# EasyEDA Pro project 嘉立创电路图.eprj

# Schematic Schematic1
Create Date: 2023-12-07; Page Name: P1; Project Name: 1; Schematic Name: Schematic1; Update Date: 2023-12-08; Company: 嘉立创EDA; Page Size: A4; Version: V1.0
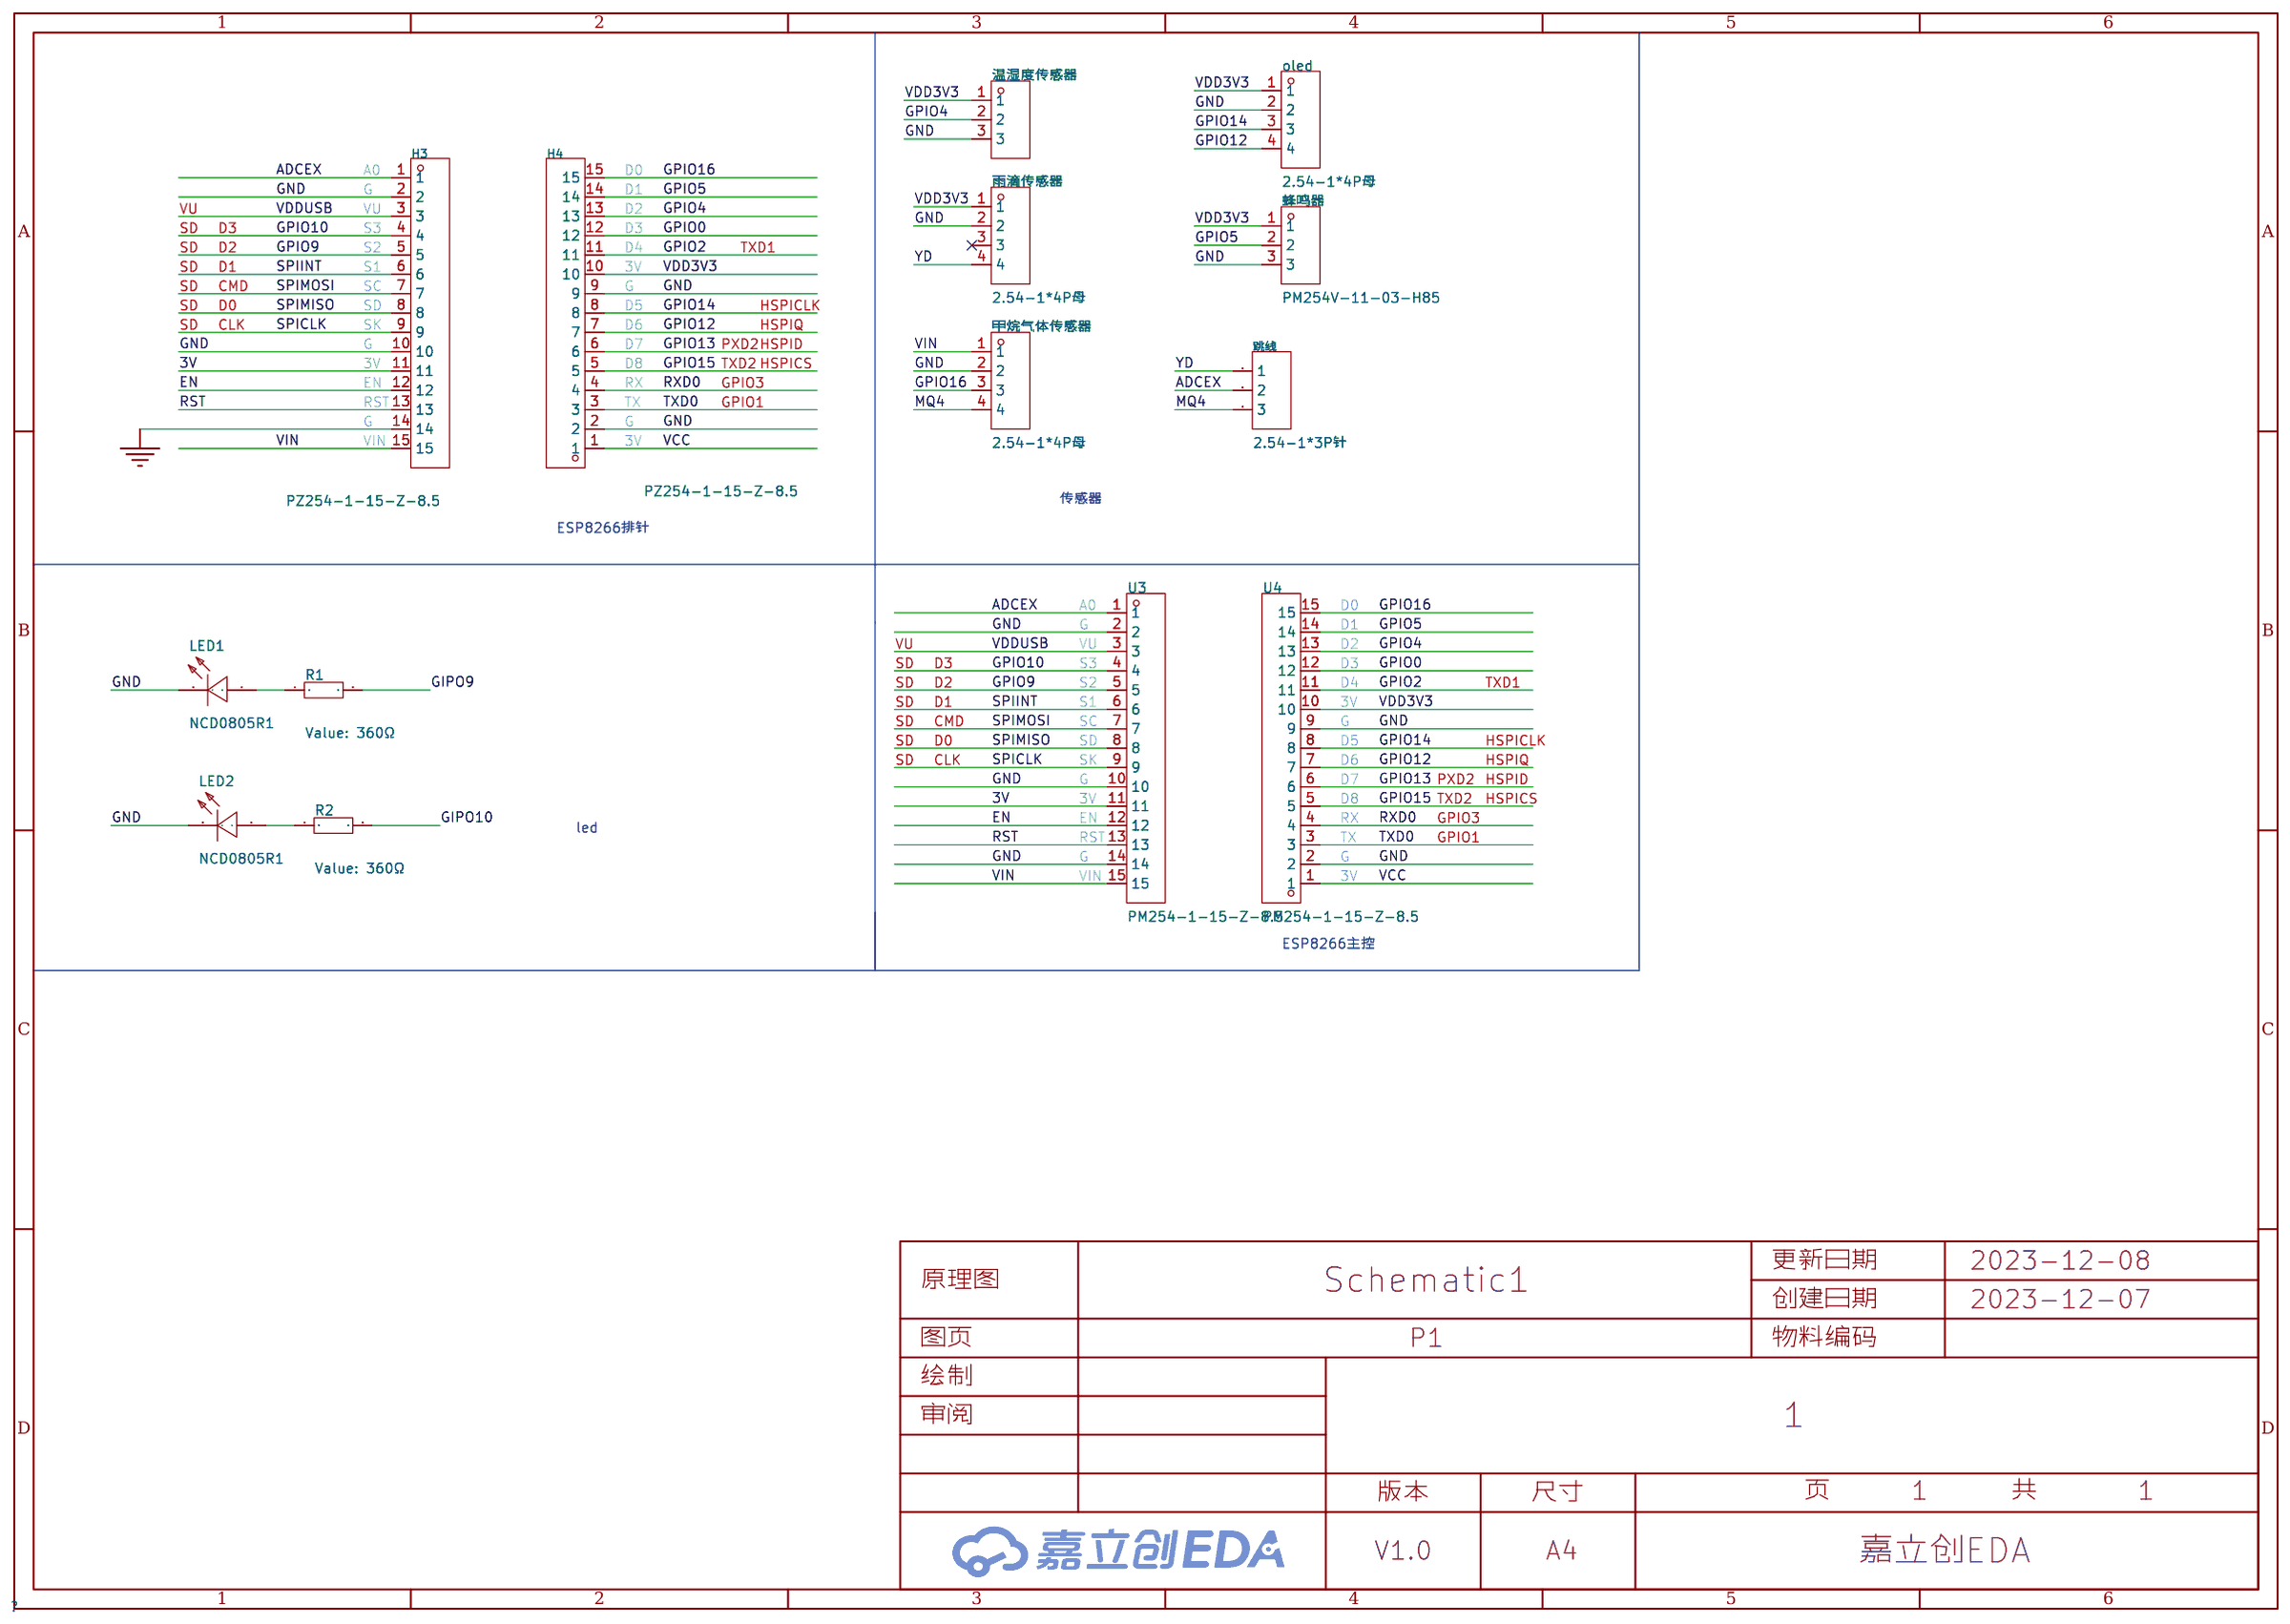
[diagram p0: schematic sheet]

## Parts
H3  PZ254-1-15-Z-8.5  [HDR-TH_15P-P2.54-V-M]
H4  PZ254-1-15-Z-8.5  [HDR-TH_15P-P2.54-V-M]
LED1  NCD0805R1  [LED0805-R-RD]
LED2  NCD0805R1  [LED0805-R-RD]
oled  2.54-1*4P母  [HDR-TH_4P-P2.54-V-F]
R1  360Ω  [R0603]
R2  360Ω  [R0603]
U3  PM254-1-15-Z-8.5  [HDR-TH_15P-P2.54-V-F]
U4  PM254-1-15-Z-8.5  [HDR-TH_15P-P2.54-V-F]
温湿度传感器  PM254V-11-03-H85  [HDR-TH_3P-P2.54-V-F]
甲烷气体传感器  2.54-1*4P母  [HDR-TH_4P-P2.54-V-F]
蜂鸣器  PM254V-11-03-H85  [HDR-TH_3P-P2.54-V-F]
跳线  2.54-1*3P针  [HDR-TH_3P-P2.54-V-M-1]
雨滴传感器  2.54-1*4P母  [HDR-TH_4P-P2.54-V-F]

## Library data of the parts
H3 H4 = PZ254-1-15-Z-8.5_C2894938: 排数:单排;总PIN位数:15;间距:2.54mm;插针结构:1x15P;行距:-;安装类型:直插;圆针/方针:方针;额定电流:3A;额定电压:-;配合针长度:6mm;塑高:2.5mm;端接针长度:3mm;触头材质:-;工作温度范围:-40℃~+105℃;颜色:黑色;; LCSC Part Name: 2.54mm 1x15P 直插 方针; Supplier Part: C2894938; Manufacturer: HCTL(华灿天禄); Supplier Footprint: 直插,P=2.54mm; JLCPCB Part Class: Extended Part; Supplier: LCSC; Number of Rows: 单排; Number of Pins: 15; Pitch: 2.54mm; Pin Structure: 1x15P; Mounting Type: 直插; Circluar Pins/Square Pins: 方针; Current Rating (Max): 3A; Length of Mating Pin: 6mm; Insulation Height: 2.5mm; Length of End Connection Pin: 3mm; Operating Temperature Range: -40℃~+105℃; Color: 黑色
LED1 LED2 = NCD0805R1: 发光颜色:红色;二极管配置:-;功率:65mW;透镜颜色:无色透明;主波长:615nm~630nm;色温:-;发光强度:67mcd~195mcd;发光角度:130°;安装方式:-;工作温度:-30℃~+85℃;; LCSC Part Name: 红灯 0805红灯   正贴; Supplier Part: C84256; Manufacturer: 国星光电; Supplier Footprint: 0805; JLCPCB Part Class: Basic Part; Datasheet: https://atta.szlcsc.com/upload/public/pdf/source/20200820/C84256_F0A75A43B3EAD75808600A0514C76B99.pdf; Supplier: LCSC; Emitted Color: 红色; Forward Voltage (VF): 1.6V~2.6V; Forward Current: 20mA; Power Dissipation: 65mW; Lens Color: 无色透明; Dominant Wavelength: 615nm~630nm; Luminous Intensity: 67mcd~195mcd; Viewing Angle: 130°; Operating Temperature: -30℃~+85℃
oled 甲烷气体传感器 雨滴传感器 = 2.54-1*4P母: 排数:单排;总孔位数:4P;间距:2.54mm;插孔结构:1x4P;行距:-;安装类型:直插;圆孔/方孔:方孔;额定电流:3A;额定电压:-;插孔方向:顶部;塑高:-;触头材质:青铜;触头镀层:-;工作温度范围:-40℃~+105℃;焊接温度(最大值):-;; LCSC Part Name: 间距:2.54mm 1x4P 直插; Supplier Part: C2718488; Manufacturer: BOOMELE(博穆精密); Supplier Footprint: 插件,P=2.54mm; JLCPCB Part Class: 扩展库; Datasheet: https://atta.szlcsc.com/upload/public/pdf/source/20210301/C2718488_F4427B881E42CAA8DDB0B1C12B3A522C.pdf; Supplier: LCSC; Number of Rows: 单排; Number of Holes: 4P; Pitch: 2.54mm; Holes Structure: 1x4P; Mounting Type: 直插; Circular Hole / Square Hole: 方孔; Current Rating (Max): 3A; Holes Direction: 顶部; Contact Material: 青铜; Operating Temperature Range: -40℃~+105℃
R1 R2 = RTT03361JTP: 电阻类型:厚膜电阻;阻值:360Ω;精度:±5%;功率:100mW;; LCSC Part Name: 360Ω ±5% 100mW; Supplier Part: C103577; Manufacturer: RALEC(旺诠); Supplier Footprint: 0603; JLCPCB Part Class: Extended Part; Datasheet: https://atta.szlcsc.com/upload/public/pdf/source/20170408/1491642924530.pdf; Supplier: LCSC; Type: 厚膜电阻; Tolerance: ±5%; Power(Watts): 100mW; Temperature Coefficient: ±100ppm/℃; Overload Voltage (Max): 75V; Operating Temperature Range: -55℃~+155℃
U3 U4 = PM254-1-15-Z-8.5: 插孔结构:1x15P;间距:2.54mm;总孔位数:15P;安装类型:直插;排数:单排;行距:-;圆孔/方孔:方孔;额定电流:3A;额定电压:-;插孔方向:顶部;塑高:8.5mm;工作温度范围:-40℃~+105℃;; LCSC Part Name: 间距:2.54mm 1x15P 直插; Supplier Part: C2897378; Manufacturer: HCTL(华灿天禄); Supplier Footprint: 插件,P=2.54mm; JLCPCB Part Class: Extended Part; Datasheet: https://atta.szlcsc.com/upload/public/pdf/source/20230609/534BE42964C679BDE98E061007C4ABD6.pdf; Supplier: LCSC; Holes Structure: 1x15P; Pitch: 2.54mm; Number of Holes: 15P; Mounting Type: 直插; Number of Rows: 单排; Circular Hole / Square Hole: 方孔; Current Rating (Max): 3A; Holes Direction: 顶部; Insulation Height: 8.5mm; Operating Temperature Range: -40℃~+105℃
温湿度传感器 蜂鸣器 = PM254V-11-03-H85: 排数:单排;总孔位数:3P;间距:2.54mm;插孔结构:1x3P;行距:-;安装类型:直插;塑高:-;触头材质:黄铜;触头镀层:-;; LCSC Part Name: 间距:2.54mm 1x3P 直插; Supplier Part: C541850; Manufacturer: XFCN(兴飞); Supplier Footprint: 插件,P=2.54mm; JLCPCB Part Class: Extended Part; Datasheet: https://atta.szlcsc.com/upload/public/pdf/source/20200518/C541849_85853D71FC67C51915A806977A588FDA.pdf; Supplier: LCSC; Number of Rows: 单排; Number of Holes: 3P; Pitch: 2.54mm; Holes Structure: 1x3P; Mounting Type: 直插; Contact Material: 黄铜
跳线 = 2.54-1*3P针: 排数:单排;总PIN位数:3;间距:2.54mm;插针结构:1x3P;行距:-;安装类型:直插;圆针/方针:方针;额定电流:3A;额定电压:-;配合针长度:-;塑高:-;端接针长度:-;触头材质:-;触头镀层:-;工作温度范围:-40℃~+105℃;颜色:黑色;; LCSC Part Name: 2.54mm 1x3P 直插 方针; Supplier Part: C49257; Manufacturer: BOOMELE(博穆精密); Supplier Footprint: 直插,P=2.54mm; JLCPCB Part Class: 扩展库; Supplier: LCSC; Number of Rows: 单排; Number of Pins: 3; Pitch: 2.54mm; Pin Structure: 1x3P; Mounting Type: 直插; Circluar Pins/Square Pins: 方针; Current Rating (Max): 3A; Operating Temperature Range: -40℃~+105℃; Color: 黑色

## Nets
3V: H3.11 U3.11
GND: H3.2 H3.10 H3.14 H4.2 H4.9 LED1.2(-) LED2.2(-) oled.2 U3.2 U3.10 U3.14 U4.2 U4.9 温湿度传感器.3 甲烷气体传感器.2 蜂鸣器.3 雨滴传感器.2
VCC: H4.1 U4.1
VDD3V3: H4.10 oled.1 U4.10 温湿度传感器.1 蜂鸣器.1 雨滴传感器.1
VDDUSB: H3.3 U3.3
VIN: H3.15 U3.15 甲烷气体传感器.1
ADCEX: H3.1 U3.1 跳线.2
EN: H3.12 U3.12
GIPO9: R1.2
GIPO10: R2.2
GPIO0: H4.12 U4.12
GPIO2: H4.11 U4.11
GPIO4: H4.13 U4.13 温湿度传感器.2
GPIO5: H4.14 U4.14 蜂鸣器.2
GPIO9: H3.5 U3.5
GPIO10: H3.4 U3.4
GPIO12: H4.7 oled.4 U4.7
GPIO13: H4.6 U4.6
GPIO14: H4.8 oled.3 U4.8
GPIO15: H4.5 U4.5
GPIO16: H4.15 U4.15 甲烷气体传感器.3
MQ4: 甲烷气体传感器.4 跳线.3
RST: H3.13 U3.13
RXD0: H4.4 U4.4
SPICLK: H3.9 U3.9
SPIINT: H3.6 U3.6
SPIMISO: H3.8 U3.8
SPIMOSI: H3.7 U3.7
TXD0: H4.3 U4.3
YD: 跳线.1 雨滴传感器.4
$1N796: LED1.1(+) R1.1
$1N936: LED2.1(+) R2.1

Not connected (* = marked no-connect by the designer): 雨滴传感器 3*

## Notes on the sheet
- A0
- D0
- G
- D1
- VU
- VU
- D2
- SD
- D3
- S3
- D3
- SD
- SD
- D1
- D2
- S1
- S2
- 3V
- D4
- TXD1
- SD
- CMD
- SC
- G
- SD
- D0
- SD
- D5
- HSPICLK
- SD
- CLK
- SK
- D6
- HSPIQ
- G
- D7
- PXD2
- HSPID
- 3V
- D8
- TXD2
- HSPICS
- EN
- RST
- RX
- TX
- GPIO1
- GPIO3
- G
- G
- VIN
- 3V
- 传感器
- ESP8266排针
- A0
- D0
- G
- D1
- VU
- VU
- D2
- SD
- D3
- S3
- D3
- SD
- SD
- D1
- D2
- S1
- S2
- 3V
- D4
- TXD1
- SD
- CMD
- SC
- G
- SD
- D0
- SD
- D5
- HSPICLK
- SD
- CLK
- SK
- D6
- HSPIQ
- G
- D7
- PXD2
- HSPID
- 3V
- D8
- TXD2
- HSPICS
- led
- EN
- RST
- RX
- TX
- GPIO1
- GPIO3
- G
- G
- VIN
- 3V
- ESP8266主控

# Schematic Schematic3
Create Date: 2023-12-25; Page Name: P1; Project Name: 1; Schematic Name: Schematic3; Update Date: 2023-12-25; Company: 嘉立创EDA; Page Size: A4; Version: V1.0
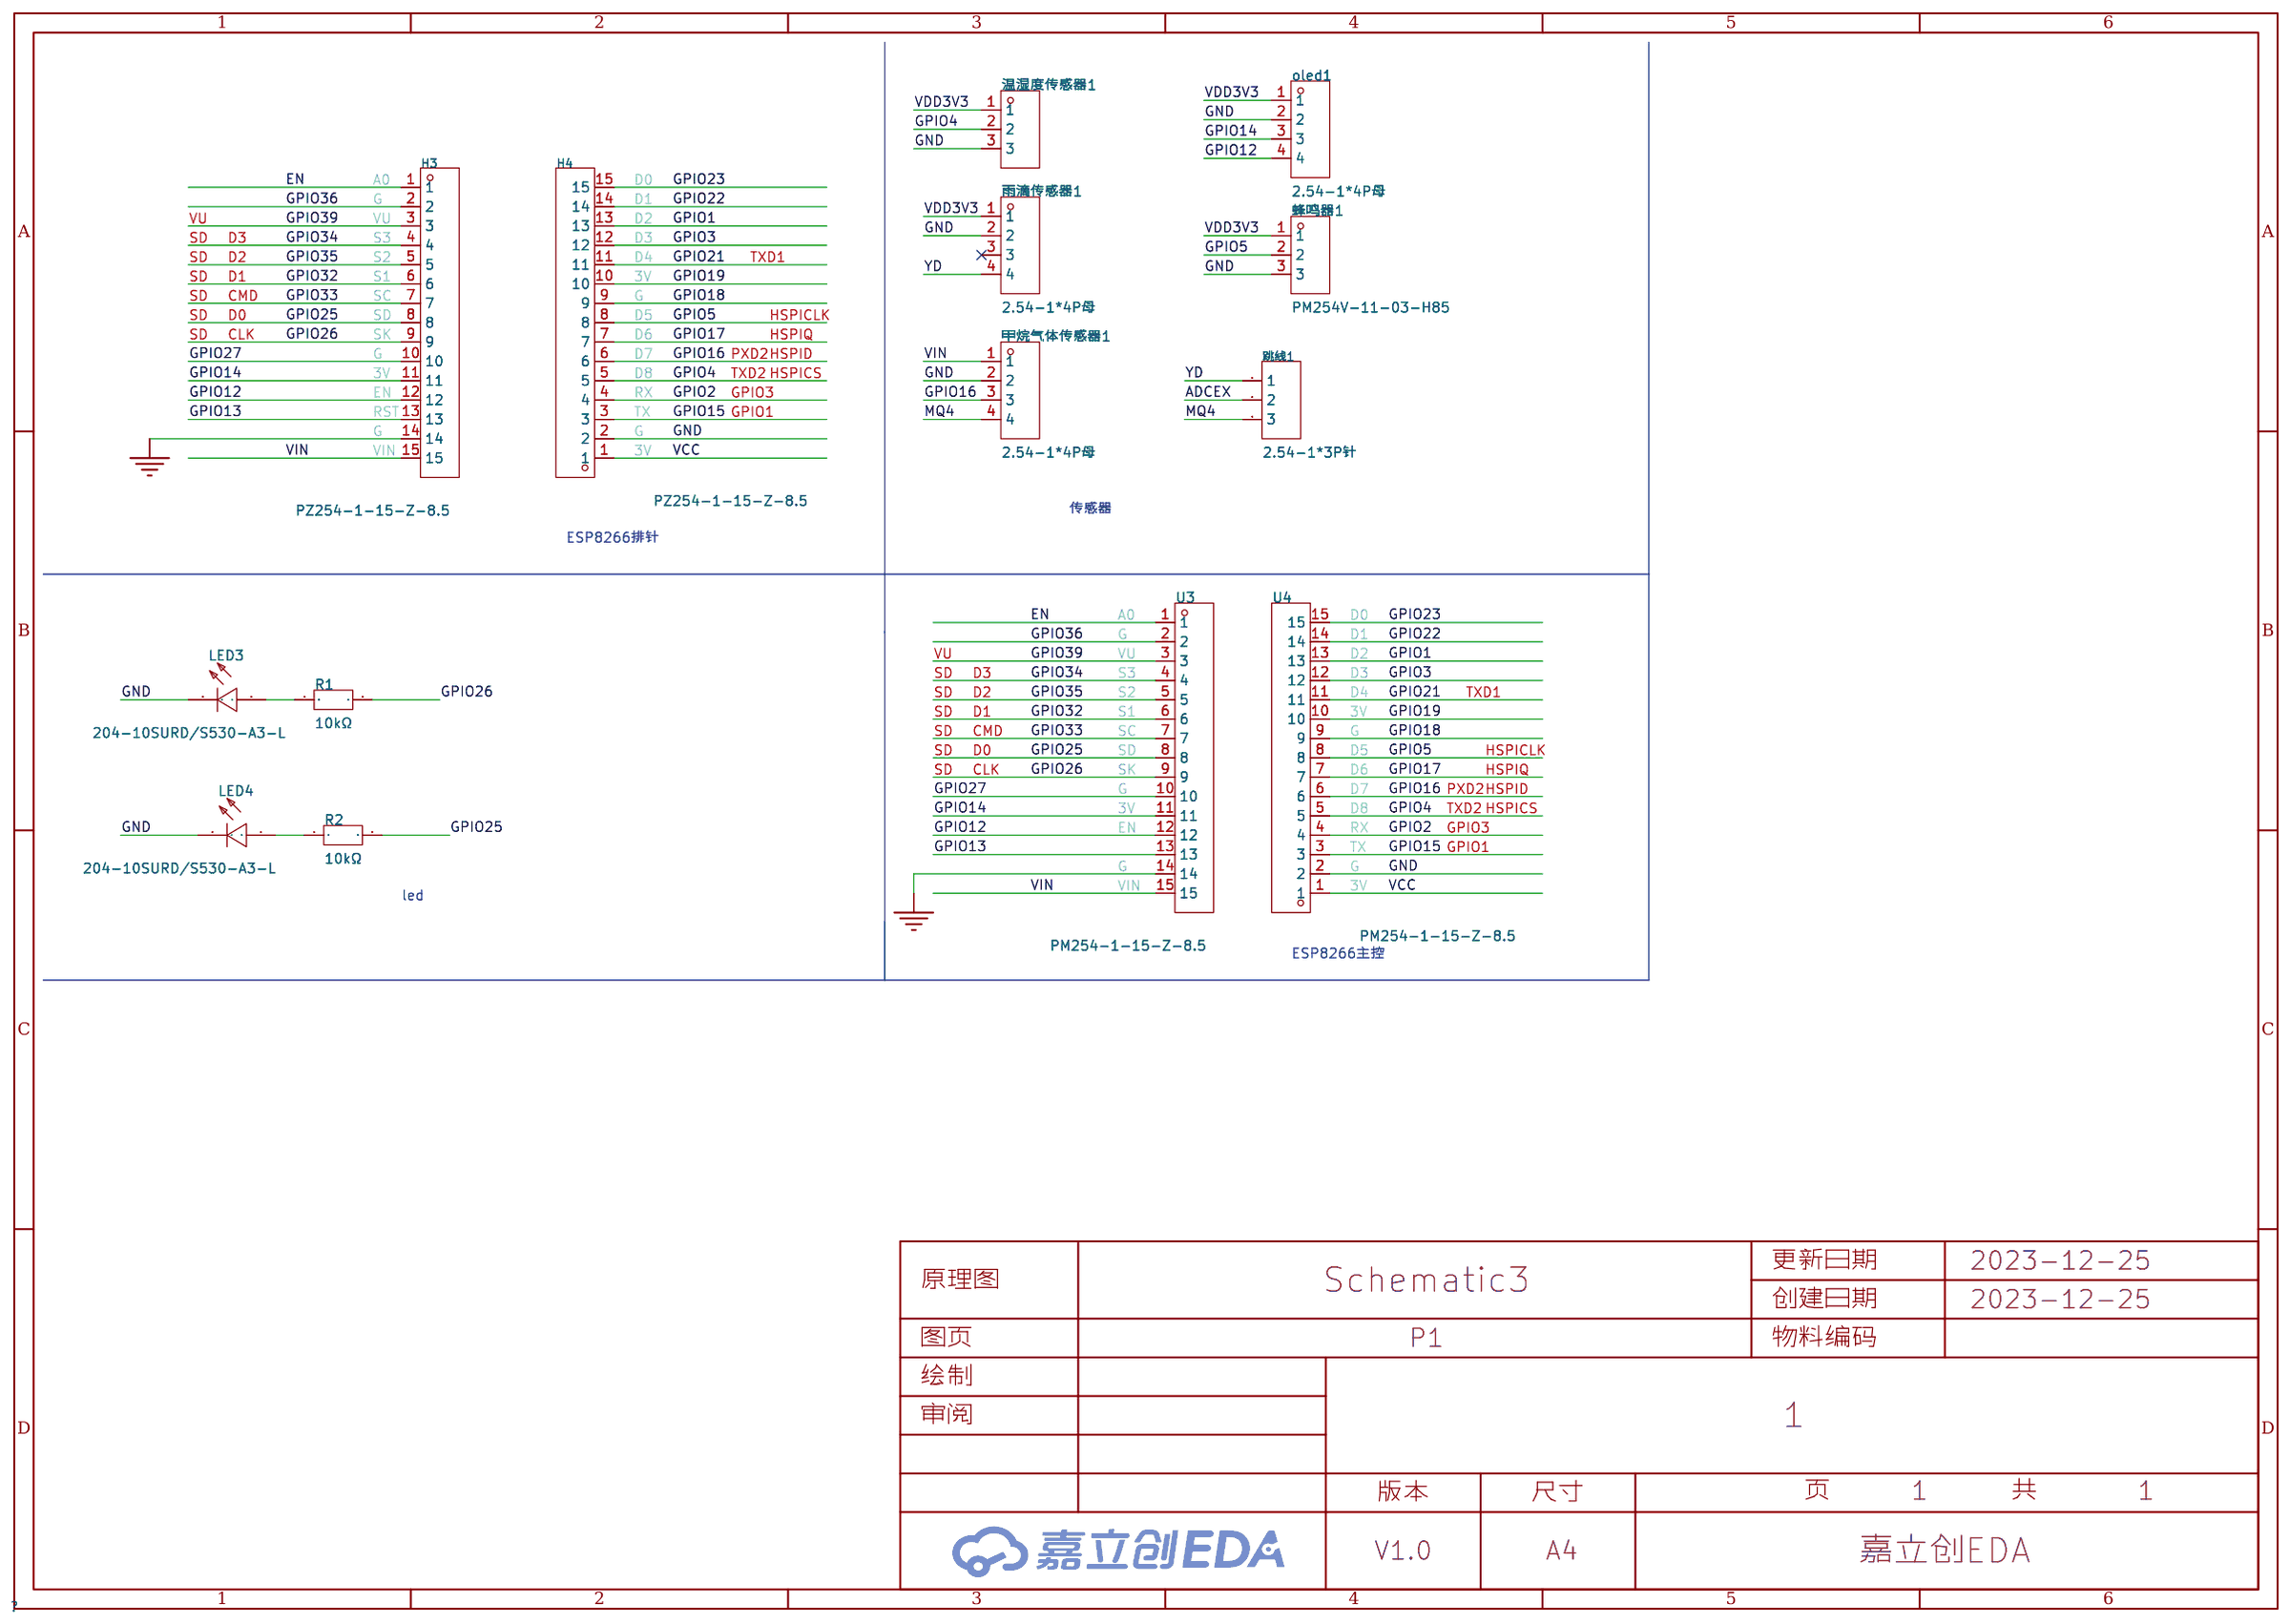
[diagram p1: schematic sheet]

## Parts
H3  PZ254-1-15-Z-8.5  [HDR-TH_15P-P2.54-V-M]
H4  PZ254-1-15-Z-8.5  [HDR-TH_15P-P2.54-V-M]
LED3  204-10SURD/S530-A3-L  [LED-TH_BD3.0-P2.54-FD]
LED4  204-10SURD/S530-A3-L  [LED-TH_BD3.0-P2.54-FD]
oled1  2.54-1*4P母  [HDR-TH_4P-P2.54-V-F]
R1  10kΩ  [RES-TH_BD2.4-L6.3-P10.30-D0.6]
R2  10kΩ  [RES-TH_BD2.4-L6.3-P10.30-D0.6]
U3  PM254-1-15-Z-8.5  [HDR-TH_15P-P2.54-V-F]
U4  PM254-1-15-Z-8.5  [HDR-TH_15P-P2.54-V-F]
温湿度传感器1  PM254V-11-03-H85  [HDR-TH_3P-P2.54-V-F]
甲烷气体传感器1  2.54-1*4P母  [HDR-TH_4P-P2.54-V-F]
蜂鸣器1  PM254V-11-03-H85  [HDR-TH_3P-P2.54-V-F]
跳线1  2.54-1*3P针  [HDR-TH_3P-P2.54-V-M-1]
雨滴传感器1  2.54-1*4P母  [HDR-TH_4P-P2.54-V-F]

## Library data of the parts
H3 H4 = PZ254-1-15-Z-8.5_C2894938: 排数:单排;总PIN位数:15;间距:2.54mm;插针结构:1x15P;行距:-;安装类型:直插;圆针/方针:方针;额定电流:3A;额定电压:-;配合针长度:6mm;塑高:2.5mm;端接针长度:3mm;触头材质:-;工作温度范围:-40℃~+105℃;颜色:黑色;; LCSC Part Name: 2.54mm 1x15P 直插 方针; Supplier Part: C2894938; Manufacturer: HCTL(华灿天禄); Supplier Footprint: 直插,P=2.54mm; JLCPCB Part Class: Extended Part; Supplier: LCSC; Number of Rows: 单排; Number of Pins: 15; Pitch: 2.54mm; Pin Structure: 1x15P; Mounting Type: 直插; Circluar Pins/Square Pins: 方针; Current Rating (Max): 3A; Length of Mating Pin: 6mm; Insulation Height: 2.5mm; Length of End Connection Pin: 3mm; Operating Temperature Range: -40℃~+105℃; Color: 黑色
LED3 LED4 = 204-10SURD/S530-A3-L: 发光颜色:红灯;二极管配置:-;主波长:624nm;色温:-;功率:60mW;安装方式:-;; LCSC Part Name: 红灯; Supplier Part: C99771; Manufacturer: EVERLIGHT(亿光); Supplier Footprint: 插件,D=3mm; JLCPCB Part Class: 扩展库; Datasheet: https://atta.szlcsc.com/upload/public/pdf/source/20170504/1493866972127.pdf; Supplier: LCSC; Emitted Color: 红灯; Lens Color: 雾状红; Dominant Wavelength: 624nm; Peak Wavelength: 632nm; Forward Current: 20mA; Power Dissipation: 60mW; Viewing Angle: 40°; Operating Temperature: -40℃~+85℃; Lamp Holder Type: 3mm圆形灯头
oled1 甲烷气体传感器1 雨滴传感器1 = 2.54-1*4P母: 排数:单排;总孔位数:4P;间距:2.54mm;插孔结构:1x4P;行距:-;安装类型:直插;圆孔/方孔:方孔;额定电流:3A;额定电压:-;插孔方向:顶部;塑高:-;触头材质:青铜;触头镀层:-;工作温度范围:-40℃~+105℃;焊接温度(最大值):-;; LCSC Part Name: 间距:2.54mm 1x4P 直插; Supplier Part: C2718488; Manufacturer: BOOMELE(博穆精密); Supplier Footprint: 插件,P=2.54mm; JLCPCB Part Class: 扩展库; Datasheet: https://atta.szlcsc.com/upload/public/pdf/source/20210301/C2718488_F4427B881E42CAA8DDB0B1C12B3A522C.pdf; Supplier: LCSC; Number of Rows: 单排; Number of Holes: 4P; Pitch: 2.54mm; Holes Structure: 1x4P; Mounting Type: 直插; Circular Hole / Square Hole: 方孔; Current Rating (Max): 3A; Holes Direction: 顶部; Contact Material: 青铜; Operating Temperature Range: -40℃~+105℃
R1 R2 = RN1/4W10KFT/BA1: 阻值:10kΩ;精度:±1%;功率:250mW;温度系数:±50ppm/℃;电阻类型:金属膜电阻;; LCSC Part Name: 10kΩ ±1% 250mW 金属膜电阻; Supplier Part: C410695; Manufacturer: Tyohm(幸亚电阻); Supplier Footprint: 插件; JLCPCB Part Class: 扩展库; Datasheet: https://atta.szlcsc.com/upload/public/pdf/source/20190808/C410699_D126E64D28B638F1D73B58E9F61DFD9B.pdf; Supplier: LCSC; Tolerance: ±1%; Power(Watts): 250mW; Overload Voltage (Max): 250V; Temperature Coefficient: ±50ppm/℃; Type: 金属膜电阻; Operating Temperature Range: -55℃~+125℃
U3 U4 = PM254-1-15-Z-8.5: 插孔结构:1x15P;间距:2.54mm;总孔位数:15P;安装类型:直插;排数:单排;行距:-;圆孔/方孔:方孔;额定电流:3A;额定电压:-;插孔方向:顶部;塑高:8.5mm;工作温度范围:-40℃~+105℃;; LCSC Part Name: 间距:2.54mm 1x15P 直插; Supplier Part: C2897378; Manufacturer: HCTL(华灿天禄); Supplier Footprint: 插件,P=2.54mm; JLCPCB Part Class: Extended Part; Datasheet: https://atta.szlcsc.com/upload/public/pdf/source/20230609/534BE42964C679BDE98E061007C4ABD6.pdf; Supplier: LCSC; Holes Structure: 1x15P; Pitch: 2.54mm; Number of Holes: 15P; Mounting Type: 直插; Number of Rows: 单排; Circular Hole / Square Hole: 方孔; Current Rating (Max): 3A; Holes Direction: 顶部; Insulation Height: 8.5mm; Operating Temperature Range: -40℃~+105℃
温湿度传感器1 蜂鸣器1 = PM254V-11-03-H85: 排数:单排;总孔位数:3P;间距:2.54mm;插孔结构:1x3P;行距:-;安装类型:直插;塑高:-;触头材质:黄铜;触头镀层:-;; LCSC Part Name: 间距:2.54mm 1x3P 直插; Supplier Part: C541850; Manufacturer: XFCN(兴飞); Supplier Footprint: 插件,P=2.54mm; JLCPCB Part Class: Extended Part; Datasheet: https://atta.szlcsc.com/upload/public/pdf/source/20200518/C541849_85853D71FC67C51915A806977A588FDA.pdf; Supplier: LCSC; Number of Rows: 单排; Number of Holes: 3P; Pitch: 2.54mm; Holes Structure: 1x3P; Mounting Type: 直插; Contact Material: 黄铜
跳线1 = 2.54-1*3P针: 排数:单排;总PIN位数:3;间距:2.54mm;插针结构:1x3P;行距:-;安装类型:直插;圆针/方针:方针;额定电流:3A;额定电压:-;配合针长度:-;塑高:-;端接针长度:-;触头材质:-;触头镀层:-;工作温度范围:-40℃~+105℃;颜色:黑色;; LCSC Part Name: 2.54mm 1x3P 直插 方针; Supplier Part: C49257; Manufacturer: BOOMELE(博穆精密); Supplier Footprint: 直插,P=2.54mm; JLCPCB Part Class: 扩展库; Supplier: LCSC; Number of Rows: 单排; Number of Pins: 3; Pitch: 2.54mm; Pin Structure: 1x3P; Mounting Type: 直插; Circluar Pins/Square Pins: 方针; Current Rating (Max): 3A; Operating Temperature Range: -40℃~+105℃; Color: 黑色

## Nets
GND: H3.14 H4.2 LED3.2(K) LED4.2(K) oled1.2 U3.14 U4.2 温湿度传感器1.3 甲烷气体传感器1.2 蜂鸣器1.3 雨滴传感器1.2
VCC: H4.1 U4.1
VDD3V3: oled1.1 温湿度传感器1.1 蜂鸣器1.1 雨滴传感器1.1
VIN: H3.15 U3.15 甲烷气体传感器1.1
ADCEX: 跳线1.2
EN: H3.1 U3.1
GPIO1: H4.13 U4.13
GPIO2: H4.4 U4.4
GPIO3: H4.12 U4.12
GPIO4: H4.5 U4.5 温湿度传感器1.2
GPIO5: H4.8 U4.8 蜂鸣器1.2
GPIO12: H3.12 oled1.4 U3.12
GPIO13: H3.13 U3.13
GPIO14: H3.11 oled1.3 U3.11
GPIO15: H4.3 U4.3
GPIO16: H4.6 U4.6 甲烷气体传感器1.3
GPIO17: H4.7 U4.7
GPIO18: H4.9 U4.9
GPIO19: H4.10 U4.10
GPIO21: H4.11 U4.11
GPIO22: H4.14 U4.14
GPIO23: H4.15 U4.15
GPIO25: H3.8 R2.2 U3.8
GPIO26: H3.9 R1.2 U3.9
GPIO27: H3.10 U3.10
GPIO32: H3.6 U3.6
GPIO33: H3.7 U3.7
GPIO34: H3.4 U3.4
GPIO35: H3.5 U3.5
GPIO36: H3.2 U3.2
GPIO39: H3.3 U3.3
MQ4: 甲烷气体传感器1.4 跳线1.3
YD: 跳线1.1 雨滴传感器1.4
$1N1035: LED4.1(A) R2.1
$1N1084: LED3.1(A) R1.1

Not connected (* = marked no-connect by the designer): 雨滴传感器1 3*

## Notes on the sheet
- A0
- G
- D0
- D1
- VU
- VU
- D2
- SD
- D3
- S3
- D3
- SD
- D2
- S2
- D4
- TXD1
- SD
- D1
- S1
- 3V
- SD
- CMD
- SC
- G
- SD
- SD
- CLK
- D0
- SD
- SK
- D5
- D6
- HSPICLK
- HSPIQ
- G
- D7
- PXD2
- HSPID
- 3V
- D8
- TXD2
- HSPICS
- EN
- RX
- GPIO3
- RST
- TX
- GPIO1
- G
- VIN
- 3V
- G
- 传感器
- ESP8266排针
- A0
- D0
- VU
- G
- VU
- D1
- D2
- SD
- D3
- S3
- D3
- SD
- D2
- S2
- D4
- TXD1
- SD
- D1
- S1
- 3V
- SD
- CMD
- SC
- G
- SD
- SD
- CLK
- D0
- SD
- SK
- D5
- D6
- HSPICLK
- HSPIQ
- G
- D7
- PXD2
- HSPID
- 3V
- D8
- TXD2
- HSPICS
- EN
- RX
- GPIO3
- TX
- GPIO1
- G
- G
- led
- VIN
- 3V
- ESP8266主控

# Board PCB1
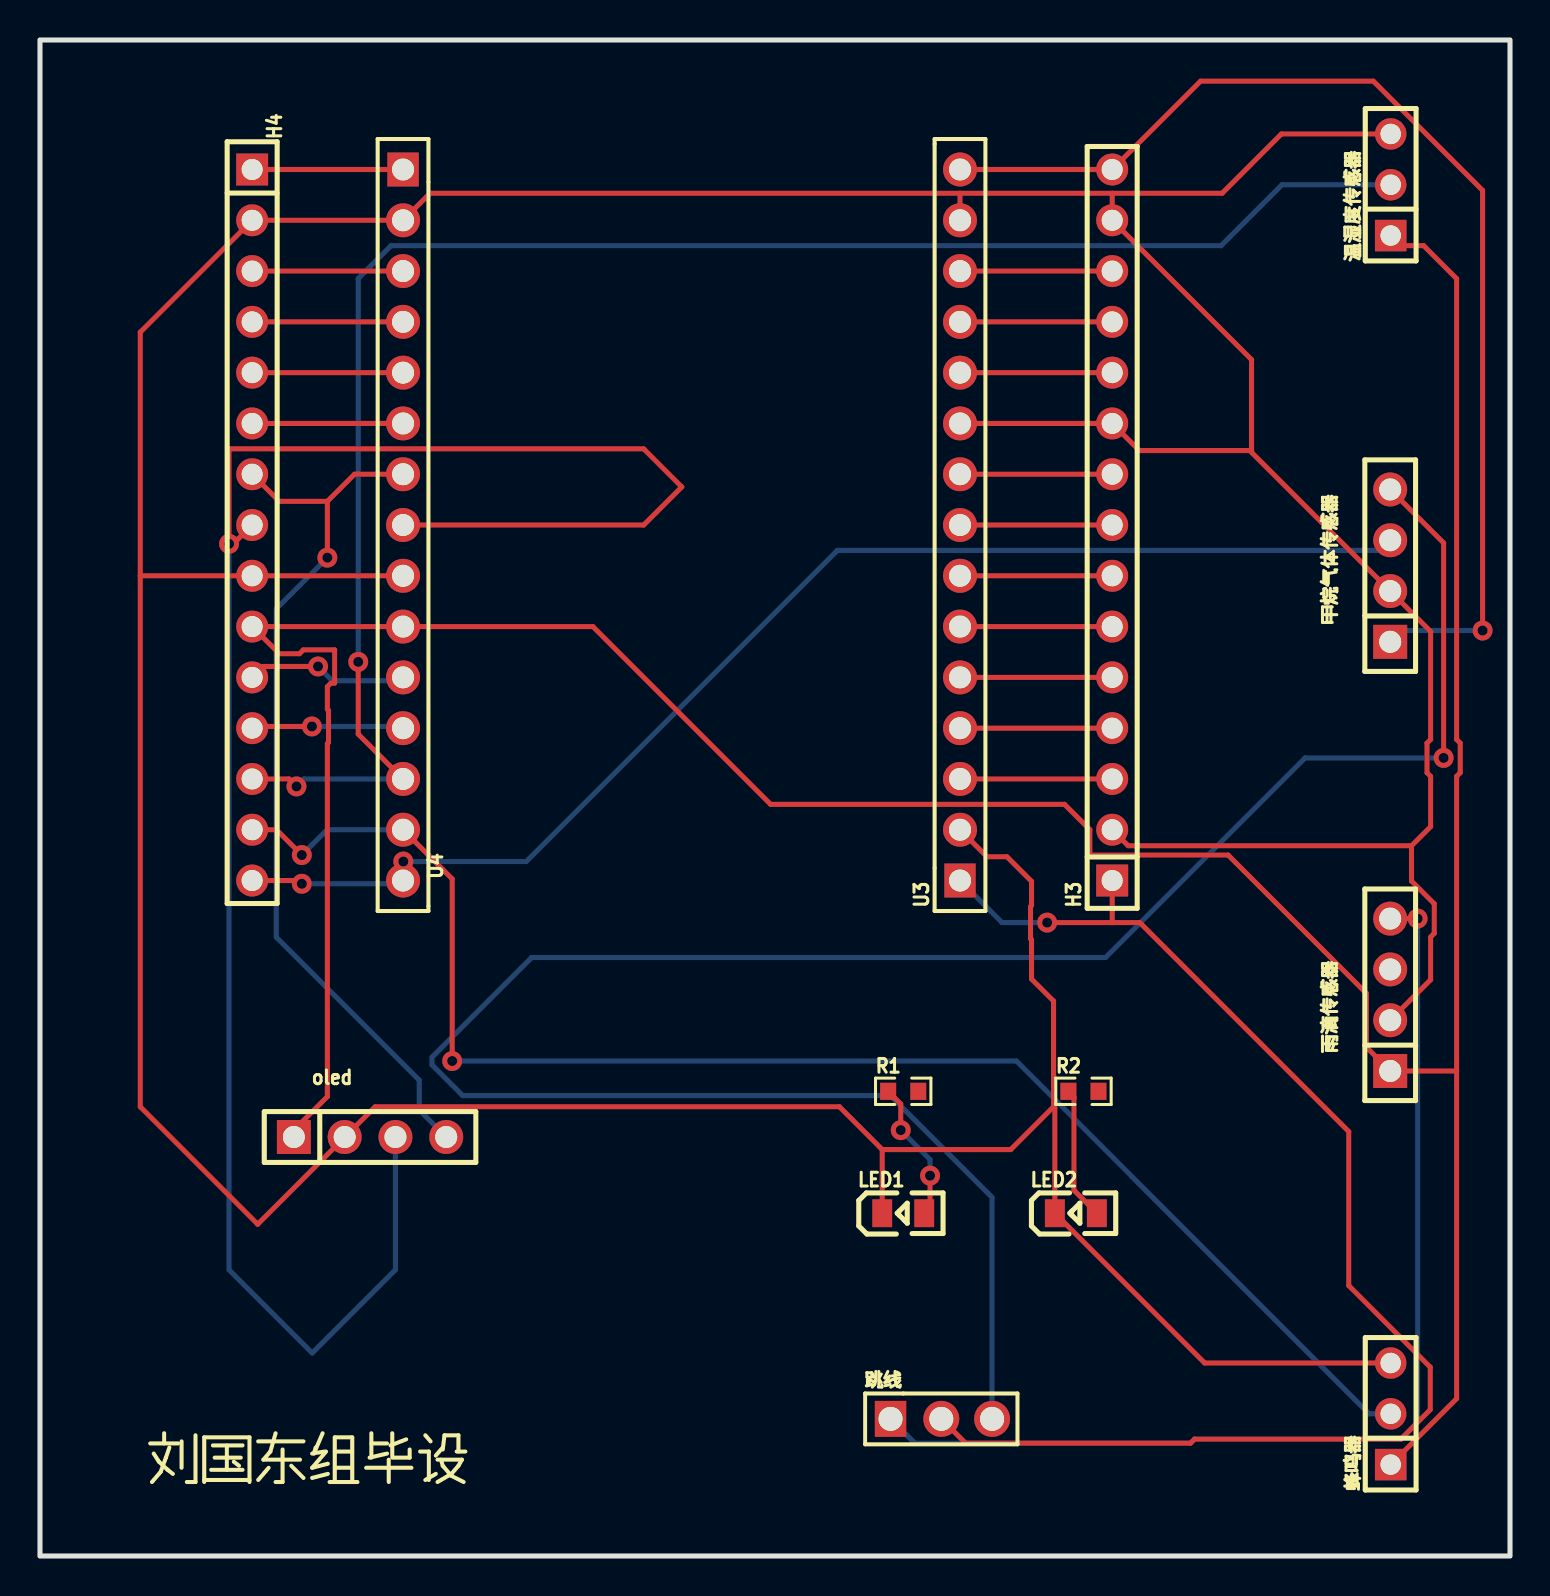
[diagram p2: board, top side]
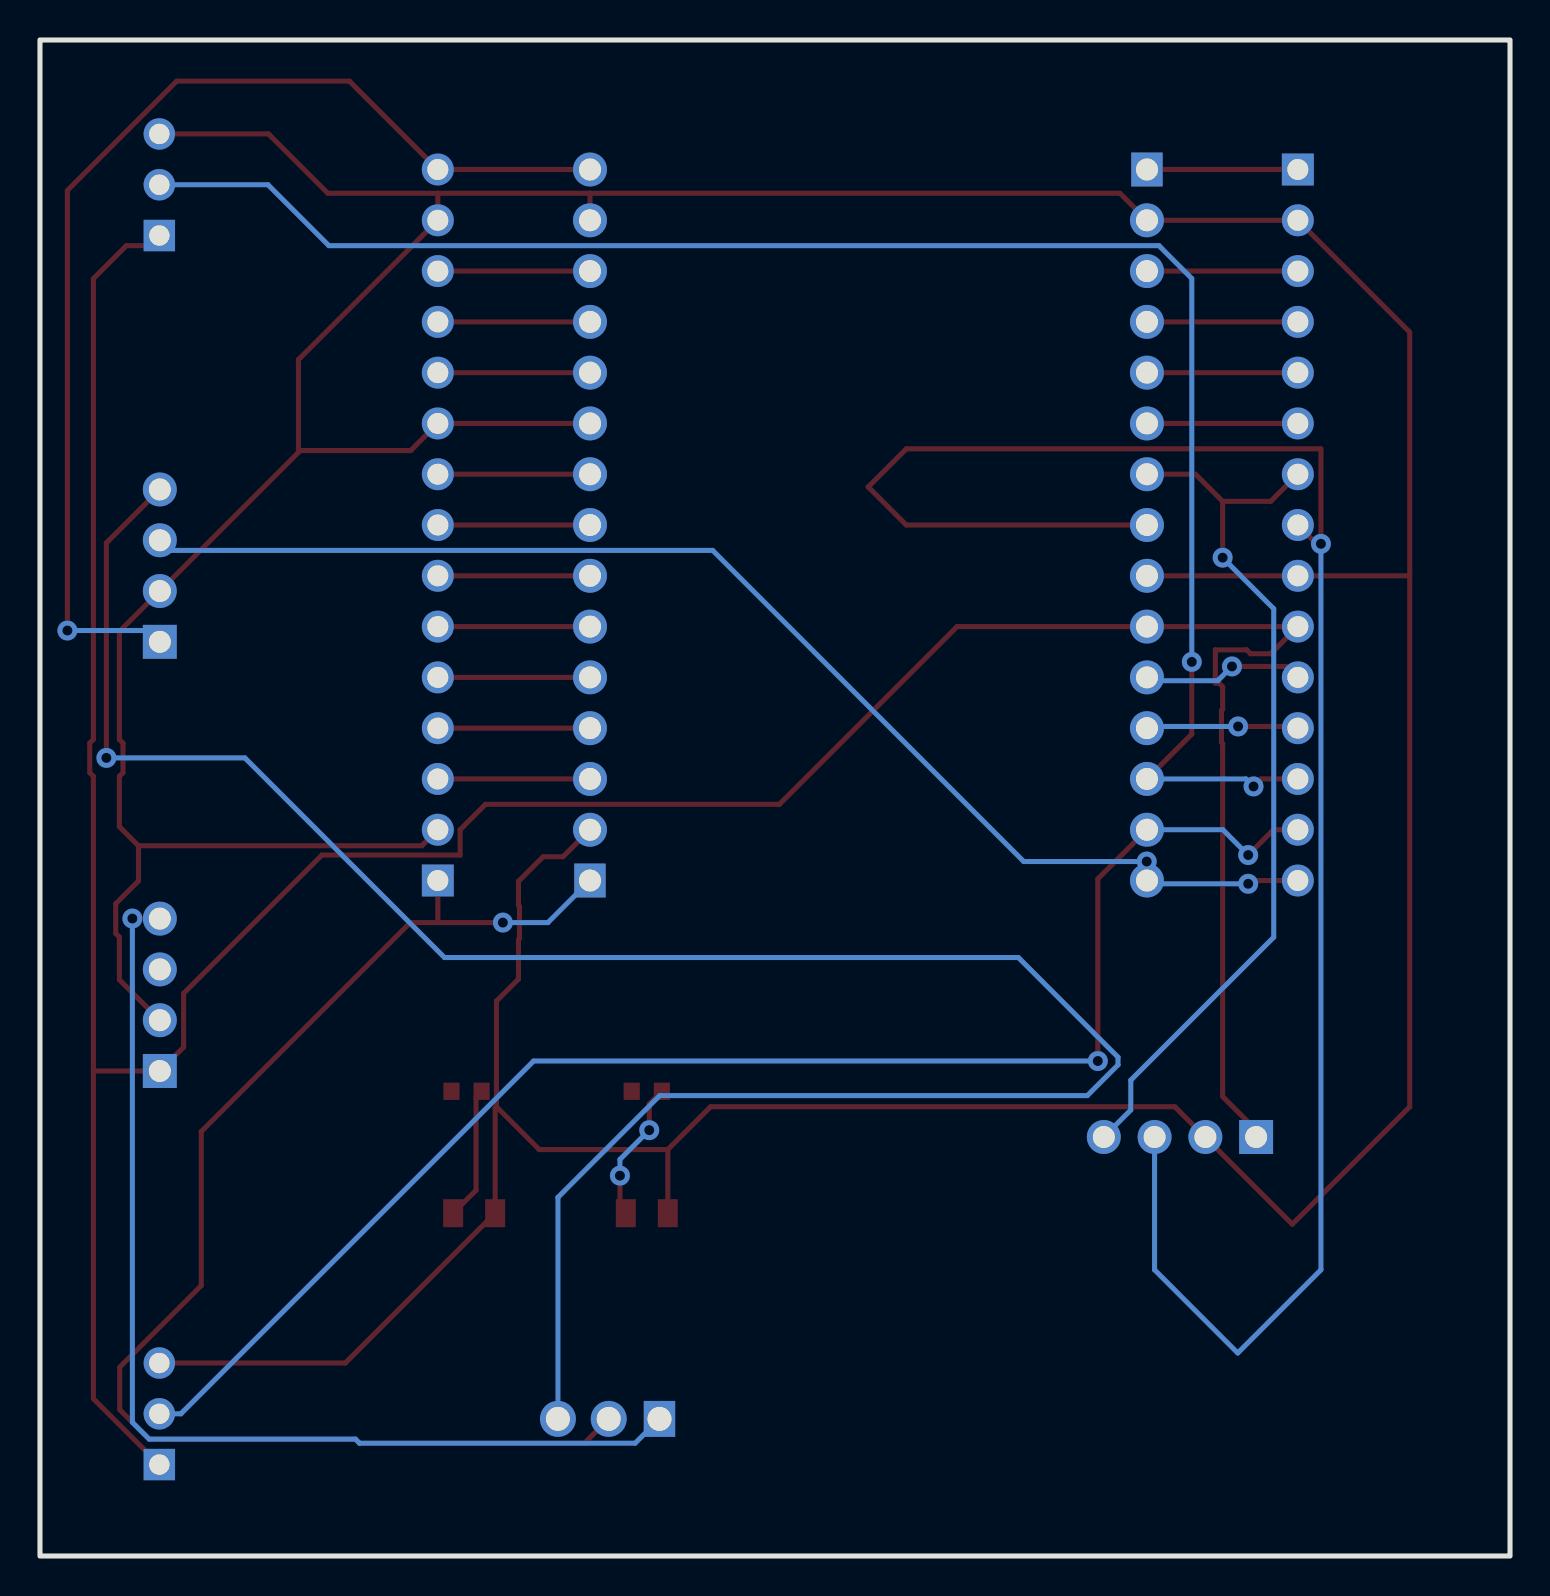
[diagram p3: board, bottom side, seen from below]

Outline 73.53 x 75.82 mm; copper layers: Top Layer, Bottom Layer. Coordinates in mm from the lower left corner of the outline.
Outline path: rectangle 0,75.82 73.53,0
Stack: Top Layer 0.035mm / Dielectric1 1.51mm FR4 er 4.5 / Bottom Layer 0.035mm

## Design rules (mm)
template: JLCPCB Capability(Single Layer Board)
spacing copperThickness1oz (default): track to track 0.102, other pairs 0.152 to 0.3
spacing copperThickness2oz: track to track 0.203, other pairs 0.152 to 0.3
track width copperThickness1oz (default): min 0.102, default 0.254, max 2.54
track width copperThickness2oz: min 0.203, default 0.254, max 2.54
differential pair differentialPair (default): width min 0.127, default 0.254, max 2.54; gap min 0.152, default 0.152
via viaSize (default): diameter min 0.5, default 1, max 10; hole min 0.3, default 0.5, max 6.3

## Placement (name value [footprint] x y rotation side)
H3  PZ254-1-15-Z-8.5  [HDR-TH_15P-P2.54-V-M]  53.63 51.56 90 top
H4  PZ254-1-15-Z-8.5  [HDR-TH_15P-P2.54-V-M]  10.61 51.56 270 top
LED1  NCD0805R1  [LED0805-R-RD]  43.18 17.15 0 top
LED2  NCD0805R1  [LED0805-R-RD]  51.82 17.15 0 top
oled  2.54-1*4P母  [HDR-TH_4P-P2.54-V-F]  16.51 20.95 0 top
R1  360Ω  [R0603]  43.18 23.24 0 top
R2  360Ω  [R0603]  52.2 23.24 0 top
U3  PM254-1-15-Z-8.5  [HDR-TH_15P-P2.54-V-F]  46.02 51.56 90 top
U4  PM254-1-15-Z-8.5  [HDR-TH_15P-P2.54-V-F]  18.16 51.56 270 top
温湿度传感器  PM254V-11-03-H85  [HDR-TH_3P-P2.54-V-F]  67.56 68.58 90 top
甲烷气体传感器  2.54-1*4P母  [HDR-TH_4P-P2.54-V-F]  67.54 49.53 90 top
蜂鸣器  PM254V-11-03-H85  [HDR-TH_3P-P2.54-V-F]  67.56 7.11 90 top
跳线  2.54-1*3P针  [HDR-TH_3P-P2.54-V-M-1]  45.09 6.86 0 top
雨滴传感器  2.54-1*4P母  [HDR-TH_4P-P2.54-V-F]  67.54 28.07 90 top

## Footprints (pads in the part's own frame, mm; a bottom-side part is the same pattern mirrored in y, then rotated)
HDR-TH_3P-P2.54-V-F
  rect 1.575x1.575 hole 1.02: 1(-2.54,0)
  round 1.575 hole 1.02: 2(0,0) 3(2.54,0)
HDR-TH_3P-P2.54-V-M-1
  rect 1.575x1.8 hole 1.2: 1(-2.54,0)
  round 1.8 hole 1.2: 2(0,0) 3(2.54,0)
HDR-TH_4P-P2.54-V-F
  rect 1.7x1.7 hole 1.1: 1(-3.81,0)
  round 1.7 hole 1.1: 2(-1.27,0) 3(1.27,0) 4(3.81,0)
HDR-TH_15P-P2.54-V-F
  rect 1.7x1.575 hole 1.1: 1(-17.78,0)
  round 1.7 hole 1.1: 2(-15.24,0) 3(-12.7,0) 4(-10.16,0) 5(-7.62,0) 6(-5.08,0) 7(-2.54,0) 8(0,0) 9(2.54,0) 10(5.08,0) 11(7.62,0) 12(10.16,0) 13(12.7,0) 14(15.24,0) 15(17.78,0)
HDR-TH_15P-P2.54-V-M
  rect 1.6x1.6 hole 1.05: 1(-17.78,0)
  round 1.6 hole 1.05: 2(-15.24,0) 3(-12.7,0) 4(-10.16,0) 5(-7.62,0) 6(-5.08,0) 7(-2.54,0) 8(0,0) 9(2.54,0) 10(5.08,0) 11(7.62,0) 12(10.16,0) 13(12.7,0) 14(15.24,0) 15(17.78,0)
LED0805-R-RD
  rect 1x1.399 smd: 1(1.05,0) 2(-1.05,0)
R0603
  rect 0.806x0.864 smd: 1(-0.753,0) 2(0.753,0)

## Nets
As in the schematic.

Pads without a net: 雨滴传感器 3

## Via types
v1: diameter 1, hole 0.5, Top Layer to Bottom Layer, 16 vias

## Routing (per net, layer and track width the routed paths; a pad name or vN(x,y) marks a point on that pad's centre or on a via; arc(x,y) is an arc through that point)
3V: length 7.6
  Top Layer w0.254: U3.11 H3.11
GND: length 297.4
  Top Layer w0.254: 60.6,55.29 60.6,59.83 H3.14 53.63,68.15 ; 60.6,55.29 60.6,55.19 甲烷气体传感器.2 69.56,46.24 69.56,40.84 69.38,40.66 69.38,39.17 69.56,38.99 69.56,36.48 68.61,35.52 ; 60.6,55.29 54.99,55.29 H3.10 U3.10 ; 15.25,20.95 10.89,16.59 5.02,22.47 5.02,49.02 ; 15.25,20.95 16.77,22.47 39.99,22.47 42.13,20.33 ; 15.25,20.95 oled.2 ; 46.02,68.15 19.51,68.15 U4.2 H4.2 5.02,61.21 5.02,49.02 ; 46.02,68.15 U3.14 ; 46.02,68.15 53.63,68.15 ; 53.63,68.15 59.13,68.15 62.1,71.12 温湿度传感器.3 ; 42.13,20.33 48.56,20.33 50.7,22.47 ; 42.13,20.33 LED1.2 ; 5.02,49.02 H4.9 U4.9 ; 蜂鸣器.3 58.26,9.65 LED2.2 50.77,22.41 50.7,22.47 ; U3.2 47.37,34.97 48.37,34.97 49.6,33.74 49.6,32.53 49.55,32.48 49.55,30.87 49.6,30.82 49.6,28.85 50.7,27.75 50.7,22.47 ; H3.2 54.43,35.52 68.61,35.52 ; 雨滴传感器.2 69.56,28.82 69.56,30.96 69.74,31.14 69.74,32.62 68.61,33.76 68.61,35.52
VCC: length 7.5
  Top Layer w0.254: U4.1 H4.1
VDD3V3: length 166.9
  Top Layer w0.254: 70.86,24.26 70.86,7.87 蜂鸣器.1 ; 70.86,24.26 70.86,38.99 71.04,39.17 71.04,40.66 70.86,40.84 70.86,63.88 69.21,65.53 68.07,65.53 温湿度传感器.1 ; 70.86,24.26 雨滴传感器.1 66.35,25.45 66.35,28.14 59.43,35.05 52.52,35.05 52.52,36.32 51.25,37.59 36.55,37.59 27.66,46.48 U4.10 H4.10 11.97,45.13 12.98,45.13 13.17,45.32 14.74,45.32 14.74,43.66 14.56,43.66 14.37,43.47 14.37,42.35 14.43,42.29 14.43,40.69 14.37,40.63 14.37,22.98 12.7,21.3 oled.1
VDDUSB: length 7.6
  Top Layer w0.254: U3.3 H3.3
VIN: length 57.1
  Top Layer w0.254: U3.15 H3.15 58.05,73.76 66.7,73.76 72.16,68.3 v1(72.16,46.28)
  Bottom Layer w0.254: 甲烷气体传感器.1 68.1,46.28 v1(72.16,46.28)
ADCEX: length 68
  Top Layer w0.254: 53.63,31.68 55.01,31.68 65.47,21.23 65.47,13.52 69.54,9.45 69.54,7.32 68.07,5.84 57.75,5.84 57.55,5.64 46.3,5.64 跳线.2 ; 53.63,31.68 H3.1 ; 53.63,31.68 v1(50.38,31.68)
  Bottom Layer w0.254: U3.1 48.12,31.68 v1(50.38,31.68)
EN: length 7.6
  Top Layer w0.254: U3.12 H3.12
GPIO0: length 7.6
  Top Layer w0.254: v1(13.6,41.49) 10.7,41.49 H4.12
  Bottom Layer w0.254: U4.12 18.07,41.49 v1(13.6,41.49)
GPIO2: length 8.1
  Top Layer w0.254: v1(13.91,44.49) 11.16,44.49 H4.11
  Bottom Layer w0.254: v1(13.91,44.49) 14.62,43.78 17.99,43.78 U4.11
GPIO4: length 87.4
  Top Layer w0.254: U4.13 15.92,41.1 v1(15.92,44.72) ; v1(12.83,38.49) 12.46,38.86 H4.13
  Bottom Layer w0.254: U4.13 13.2,38.86 v1(12.83,38.49) ; v1(15.92,44.72) 15.92,63.89 17.56,65.53 59.08,65.53 62.13,68.58 温湿度传感器.2
GPIO5: length 75.4
  Top Layer w0.254: v1(20.62,24.75) 20.62,33.86 U4.14 ; H4.14 11.83,36.32 v1(13.1,35.06)
  Bottom Layer w0.254: U4.14 14.36,36.32 v1(13.1,35.06) ; 蜂鸣器.2 66.48,7.11 48.84,24.75 v1(20.62,24.75)
GPIO9: length 7.6
  Top Layer w0.254: U3.5 H3.5
GPIO10: length 7.6
  Top Layer w0.254: U3.4 H3.4
GPIO12: length 45
  Top Layer w0.254: H4.7 11.97,52.75 14.37,52.75 ; U4.7 15.73,54.1 14.37,52.75 ; 14.37,52.75 v1(14.37,49.93)
  Bottom Layer w0.254: v1(14.37,49.93) 11.82,47.38 11.82,30.95 18.97,23.8 18.97,22.31 oled.4
GPIO13: length 7.5
  Top Layer w0.254: U4.6 H4.6
GPIO14: length 99.1
  Top Layer w0.254: H4.8 9.9,50.84 9.46,50.84 ; 9.46,50.84 9.46,55.37 30.2,55.37 32.1,53.47 30.2,51.56 U4.8 ; 9.46,50.84 v1(9.46,50.62)
  Bottom Layer w0.254: v1(9.46,50.62) 9.46,14.31 13.62,10.15 17.78,14.31 oled.3
GPIO15: length 7.5
  Top Layer w0.254: U4.5 H4.5
GPIO16: length 64.7
  Top Layer w0.254: H4.15 12.93,33.78 v1(13.1,33.62) ; v1(18.17,34.73) 18.17,33.79 U4.15
  Bottom Layer w0.254: 甲烷气体传感器.3 67.03,50.29 39.88,50.29 24.32,34.73 v1(18.17,34.73) ; U4.15 18,33.62 v1(13.1,33.62)
MQ4: length 113.6
  Top Layer w0.254: 甲烷气体传感器.4 70.21,50.67 v1(70.21,39.91)
  Bottom Layer w0.254: 跳线.3 47.62,17.93 42.53,23.03 21.14,23.03 19.61,24.56 19.61,24.95 24.59,29.93 53.3,29.93 63.28,39.91 v1(70.21,39.91)
RST: length 7.6
  Top Layer w0.254: U3.13 H3.13
RXD0: length 7.5
  Top Layer w0.254: U4.4 H4.4
SPICLK: length 7.6
  Top Layer w0.254: U3.9 H3.9
SPIINT: length 7.6
  Top Layer w0.254: U3.6 H3.6
SPIMISO: length 7.6
  Top Layer w0.254: U3.8 H3.8
SPIMOSI: length 7.6
  Top Layer w0.254: U3.7 H3.7
TXD0: length 7.5
  Top Layer w0.254: U4.3 H4.3
YD: length 53.9
  Top Layer w0.254: 雨滴传感器.4 67.54,31.88 v1(68.91,31.88)
  Bottom Layer w0.254: v1(68.91,31.88) 68.91,6.69 68.07,5.84 57.75,5.84 57.55,5.64 43.76,5.64 42.54,6.86
$1N796: length 7.1
  Top Layer w0.254: v1(43.06,21.3) 43.06,22.61 R1.1 ; v1(44.52,19.02) 44.52,17.44 LED1.1
  Bottom Layer w0.254: v1(44.52,19.02) 44.52,19.83 v1(43.06,21.3)
$1N936: length 6.7
  Top Layer w0.254: LED2.1 51.72,18.29 51.72,22.96 R2.1

## Text on the board
Top Silkscreen Layer: 刘国东组毕设

# Board PCB3
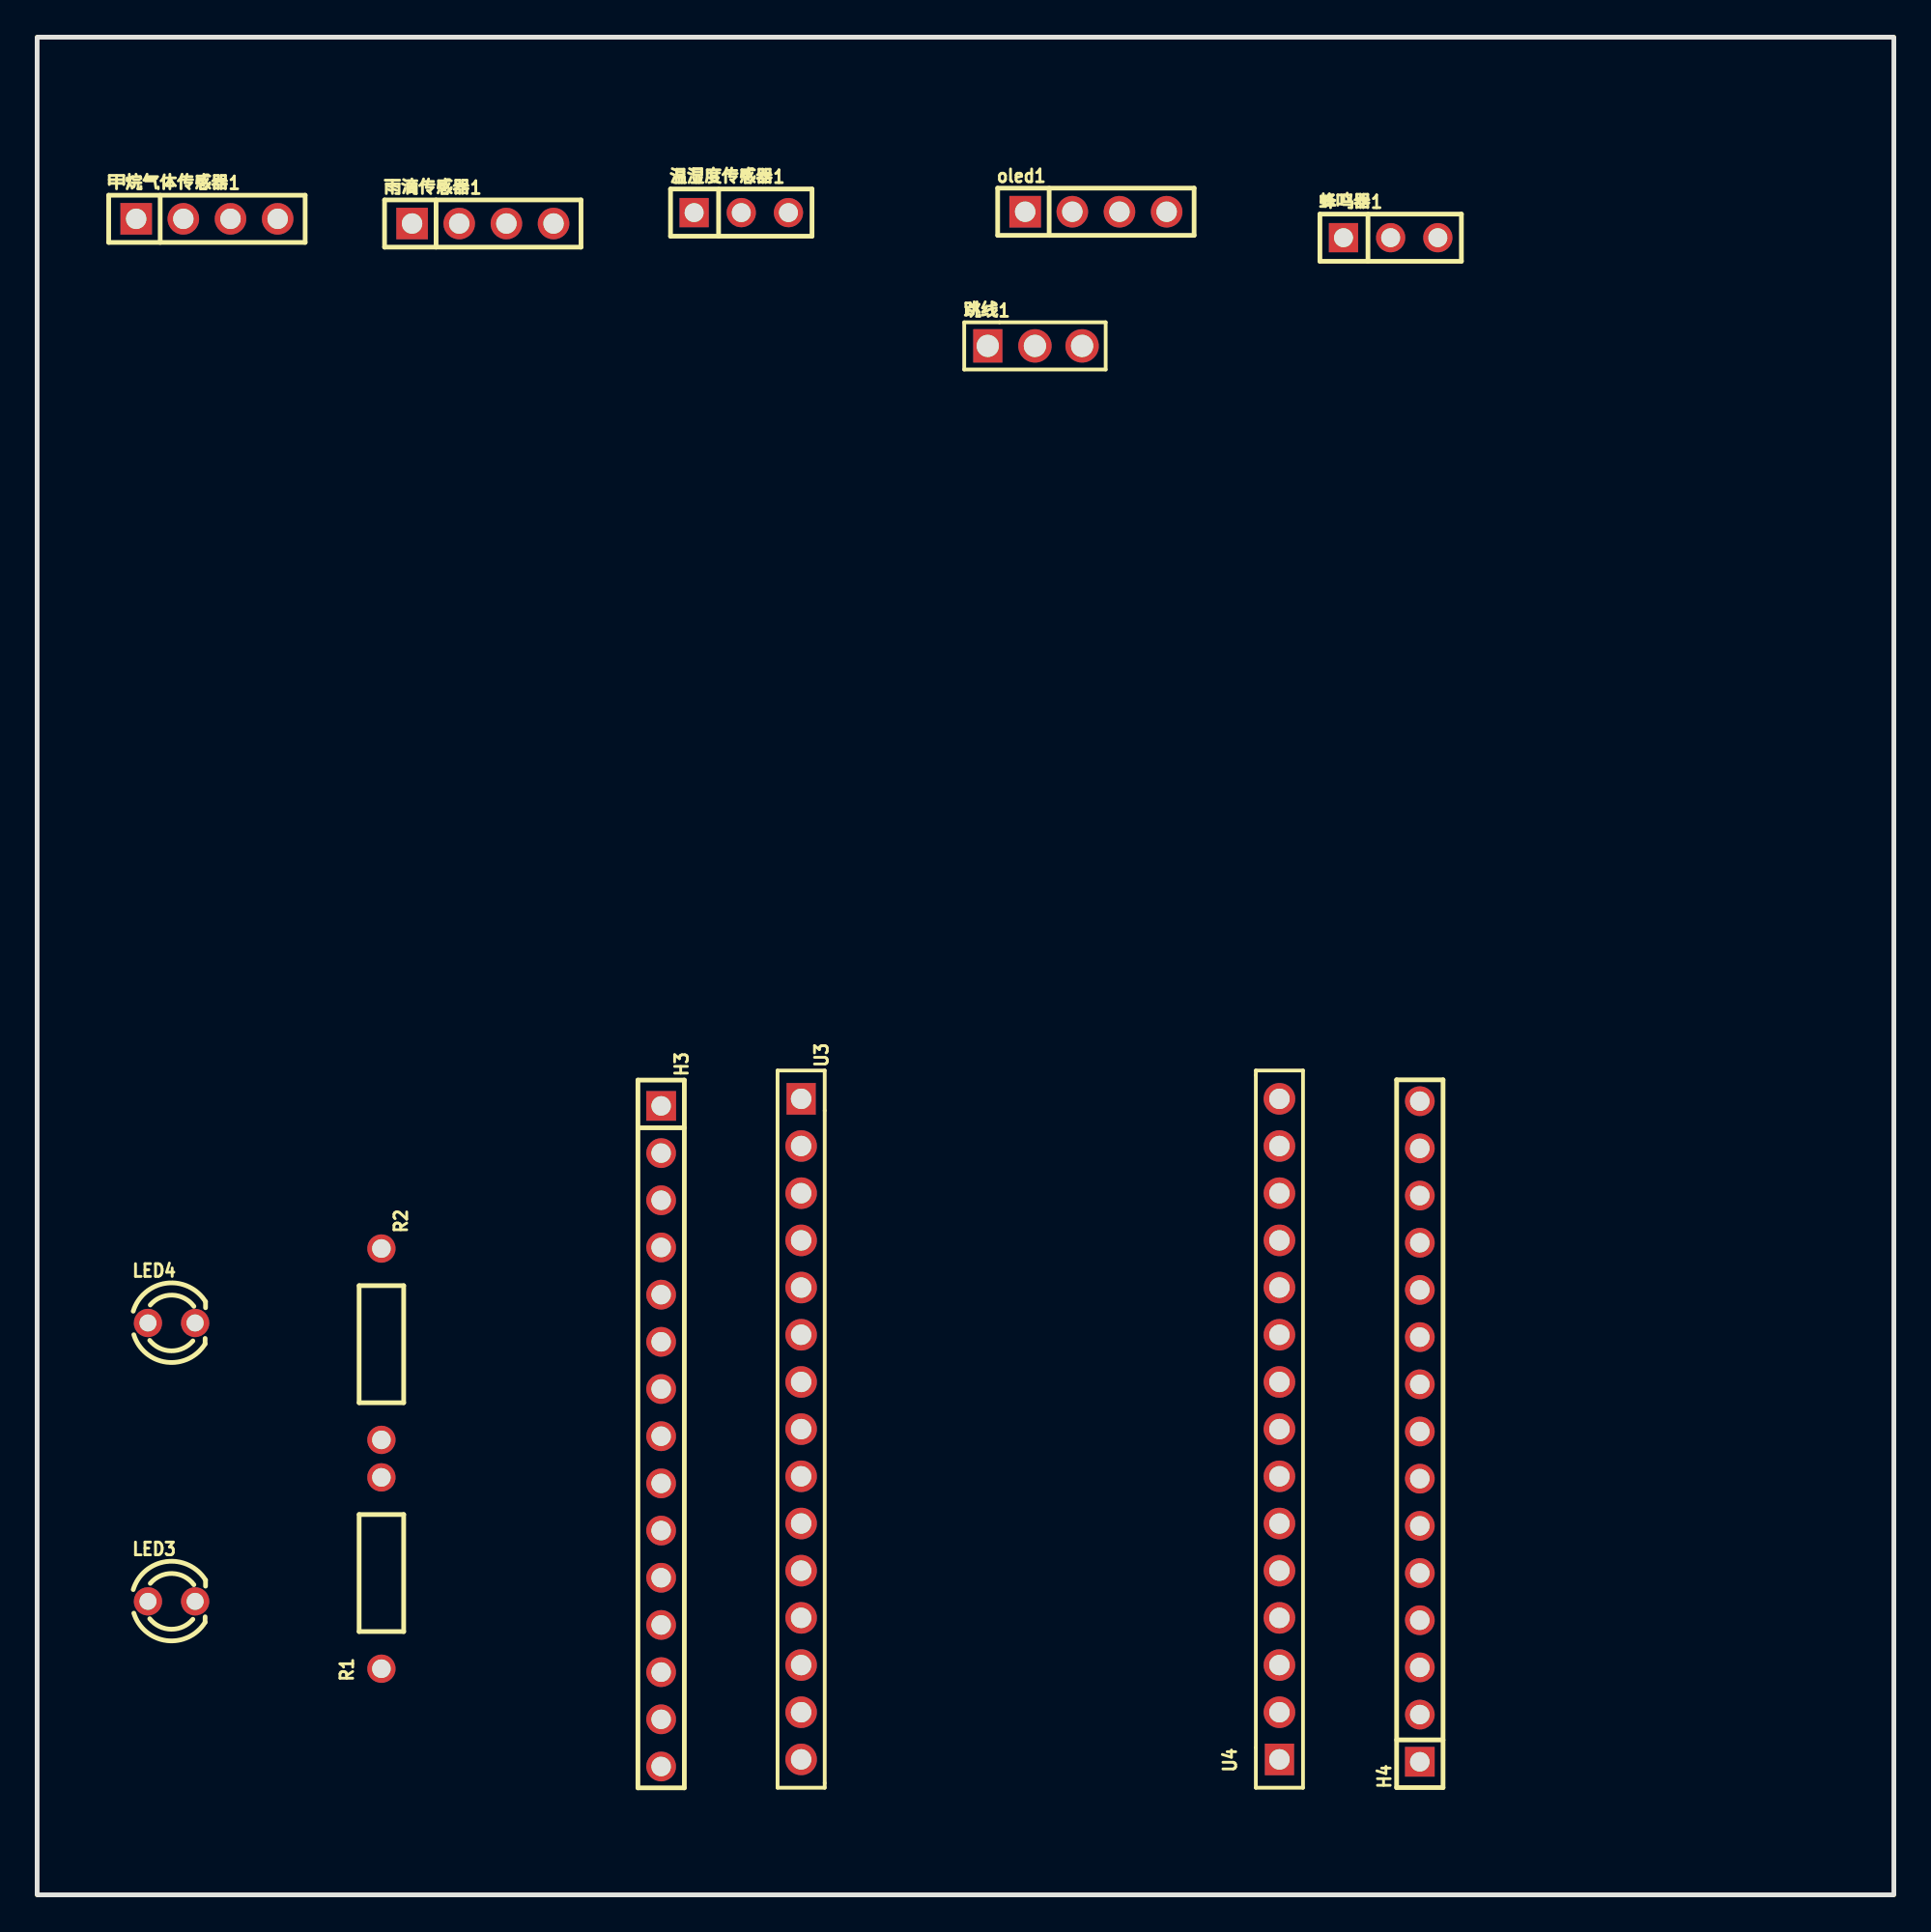
[diagram p4: board, top side]
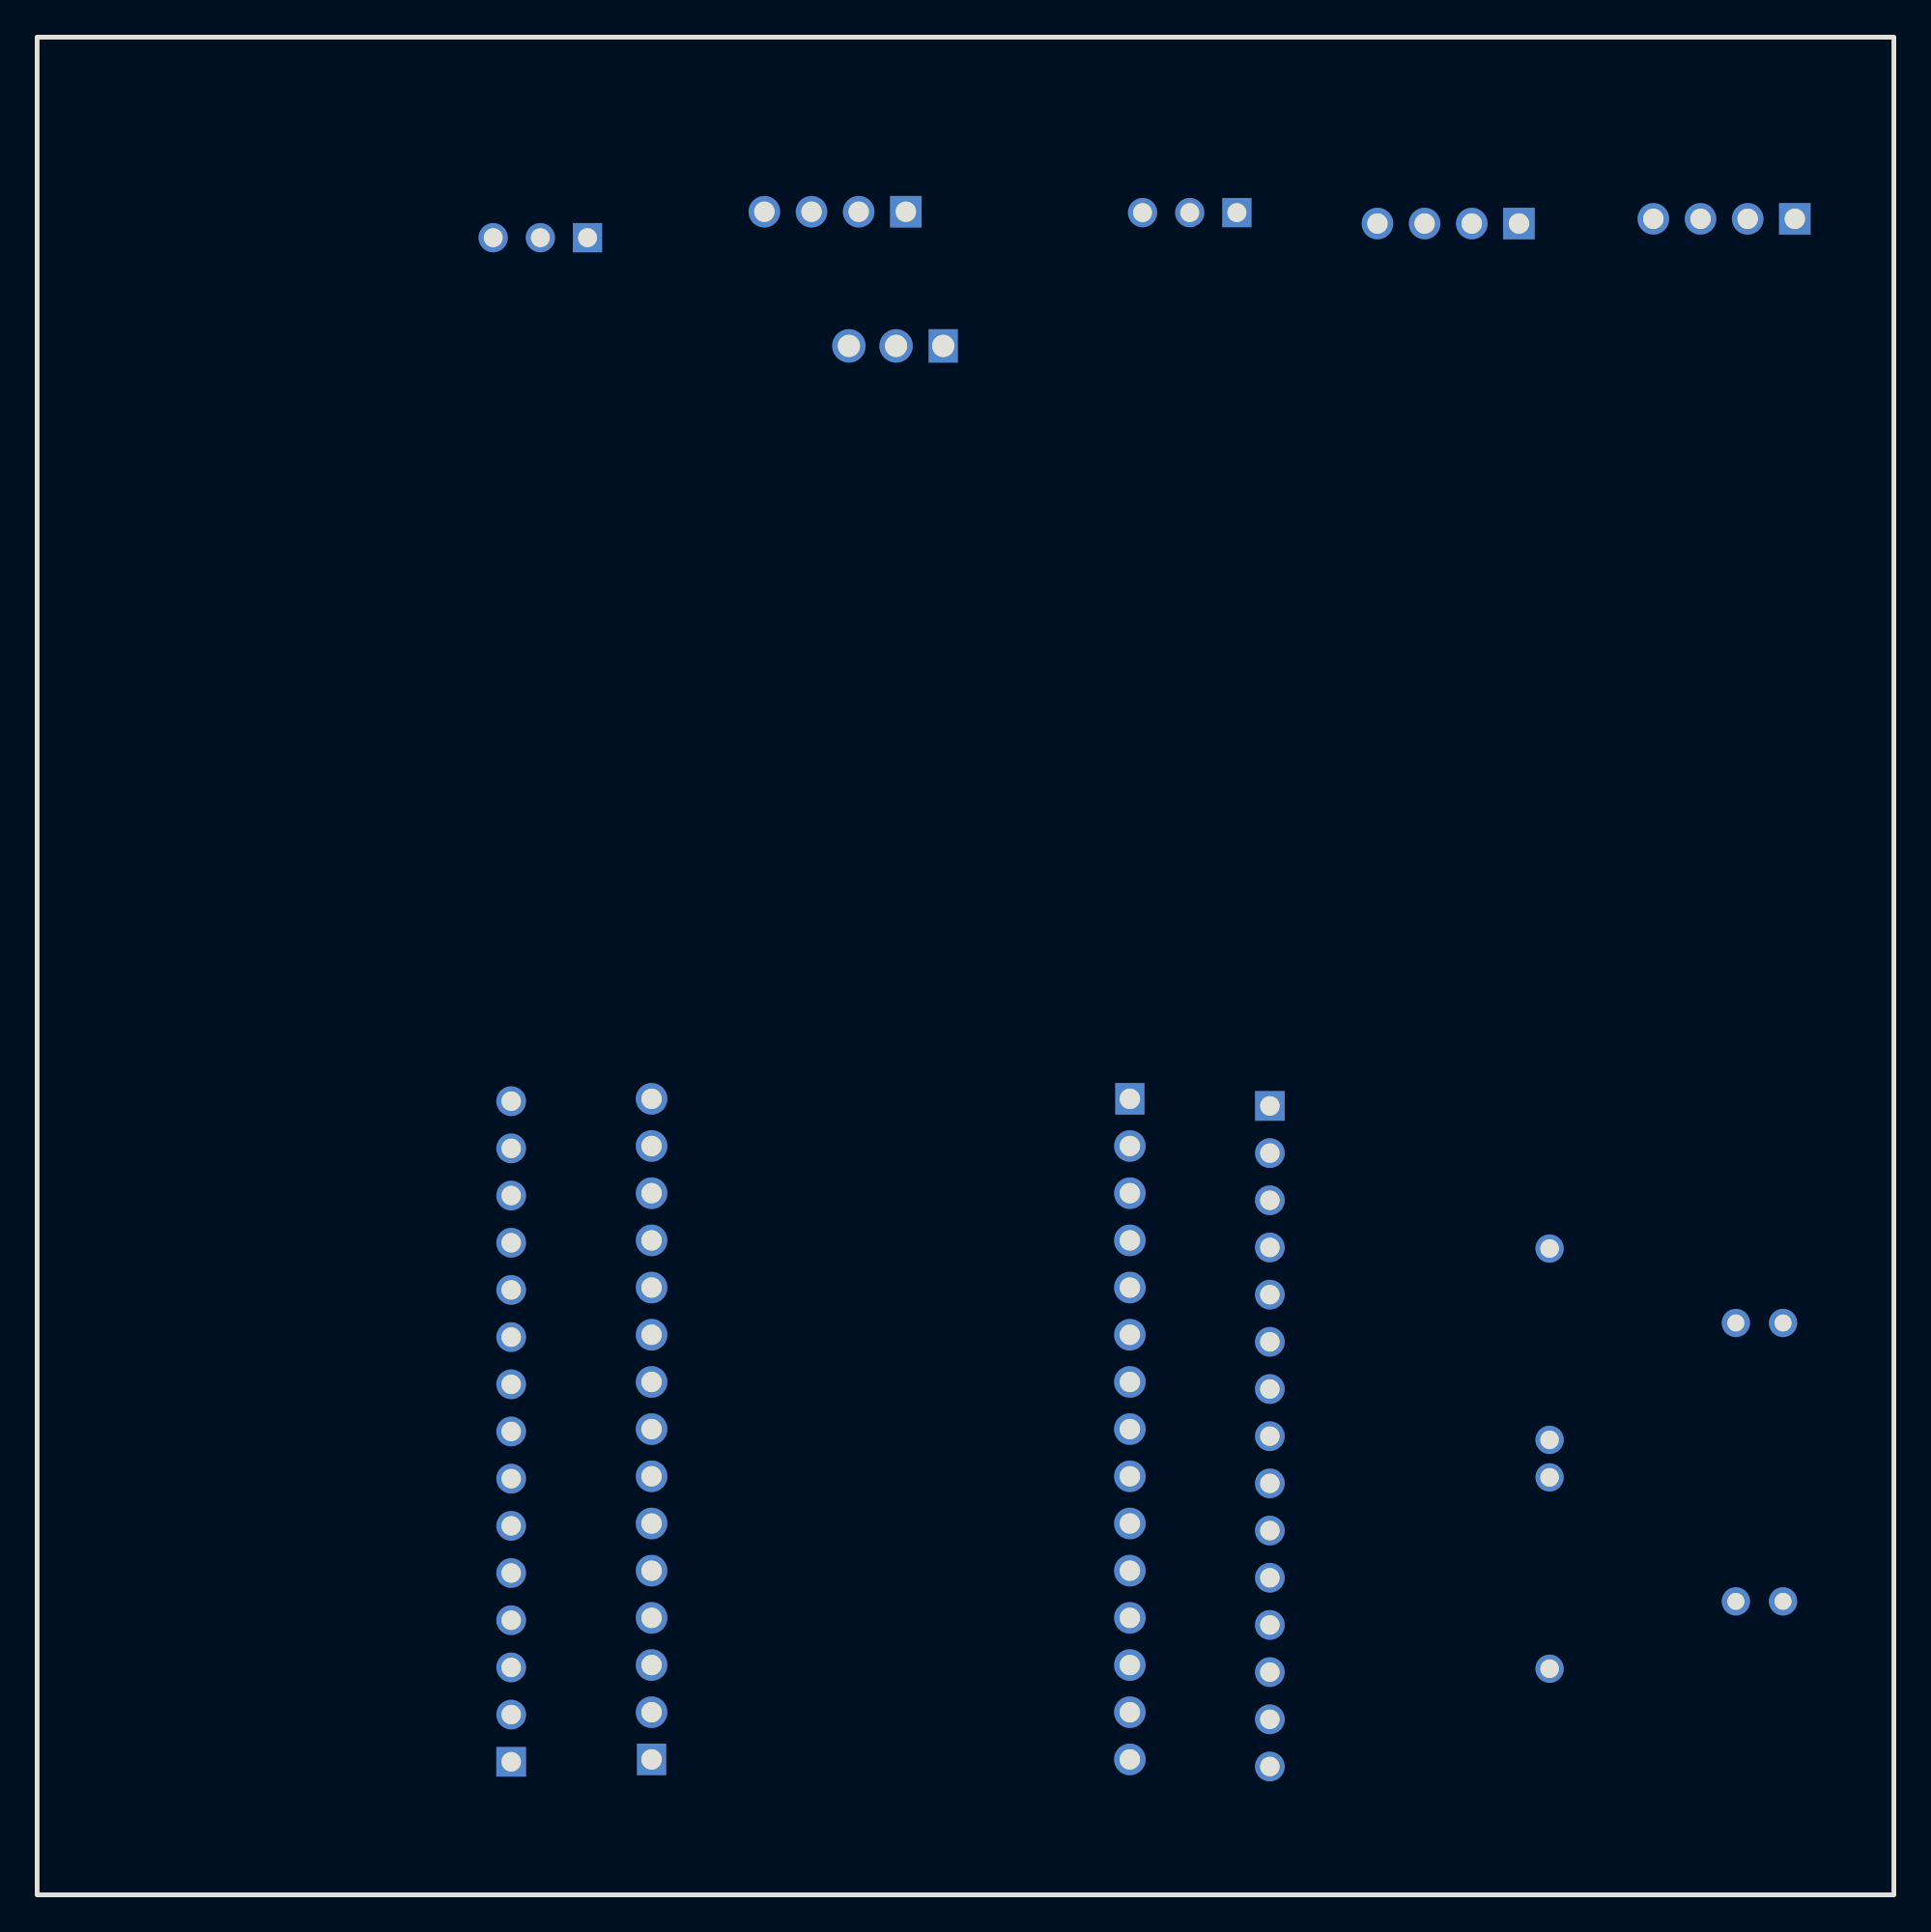
[diagram p5: board, bottom side, seen from below]

Outline 100 x 100 mm; copper layers: Top Layer, Bottom Layer. Coordinates in mm from the lower left corner of the outline.
Outline path: rectangle 0,100 100,0
Stack: Top Layer 0.035mm / Dielectric1 1.51mm FR4 er 4.5 / Bottom Layer 0.035mm

## Design rules (mm)
template: JLCPCB Capability(Two Layers Board)
spacing copperThickness1oz (default): track to track 0.102, other pairs 0.152 to 0.3
spacing copperThickness2oz: track to track 0.203, other pairs 0.152 to 0.3
track width copperThickness1oz (default): min 0.127, default 0.254, max 2.54
track width copperThickness2oz: min 0.203, default 0.254, max 2.54
differential pair differentialPair (default): width min 0.127, default 0.254, max 2.54; gap min 0.152, default 0.152
via viaSize (default): diameter min 0.5, default 0.61, max 10; hole min 0.3, default 0.305, max 6.3

## Placement (name value [footprint] x y rotation side)
H3  PZ254-1-15-Z-8.5  [HDR-TH_15P-P2.54-V-M]  33.61 24.69 270 top
H4  PZ254-1-15-Z-8.5  [HDR-TH_15P-P2.54-V-M]  74.47 24.94 90 top
LED3  204-10SURD/S530-A3-L  [LED-TH_BD3.0-P2.54-FD]  7.24 15.8 0 top
LED4  204-10SURD/S530-A3-L  [LED-TH_BD3.0-P2.54-FD]  7.24 30.79 0 top
oled1  2.54-1*4P母  [HDR-TH_4P-P2.54-V-F]  57.02 90.6 0 top
R1  10kΩ  [RES-TH_BD2.4-L6.3-P10.30-D0.6]  18.54 17.32 90 top
R2  10kΩ  [RES-TH_BD2.4-L6.3-P10.30-D0.6]  18.54 29.64 270 top
U3  PM254-1-15-Z-8.5  [HDR-TH_15P-P2.54-V-F]  41.15 25.07 270 top
U4  PM254-1-15-Z-8.5  [HDR-TH_15P-P2.54-V-F]  66.91 25.07 90 top
温湿度传感器1  PM254V-11-03-H85  [HDR-TH_3P-P2.54-V-F]  37.92 90.56 0 top
甲烷气体传感器1  2.54-1*4P母  [HDR-TH_4P-P2.54-V-F]  9.14 90.22 0 top
蜂鸣器1  PM254V-11-03-H85  [HDR-TH_3P-P2.54-V-F]  72.9 89.21 0 top
跳线1  2.54-1*3P针  [HDR-TH_3P-P2.54-V-M-1]  53.74 83.38 0 top
雨滴传感器1  2.54-1*4P母  [HDR-TH_4P-P2.54-V-F]  24 89.97 0 top

## Footprints (pads in the part's own frame, mm; a bottom-side part is the same pattern mirrored in y, then rotated)
HDR-TH_3P-P2.54-V-F
  rect 1.575x1.575 hole 1.02: 1(-2.54,0)
  round 1.575 hole 1.02: 2(0,0) 3(2.54,0)
HDR-TH_3P-P2.54-V-M-1
  rect 1.575x1.8 hole 1.2: 1(-2.54,0)
  round 1.8 hole 1.2: 2(0,0) 3(2.54,0)
HDR-TH_4P-P2.54-V-F
  rect 1.7x1.7 hole 1.1: 1(-3.81,0)
  round 1.7 hole 1.1: 2(-1.27,0) 3(1.27,0) 4(3.81,0)
HDR-TH_15P-P2.54-V-F
  rect 1.7x1.575 hole 1.1: 1(-17.78,0)
  round 1.7 hole 1.1: 2(-15.24,0) 3(-12.7,0) 4(-10.16,0) 5(-7.62,0) 6(-5.08,0) 7(-2.54,0) 8(0,0) 9(2.54,0) 10(5.08,0) 11(7.62,0) 12(10.16,0) 13(12.7,0) 14(15.24,0) 15(17.78,0)
HDR-TH_15P-P2.54-V-M
  rect 1.6x1.6 hole 1.05: 1(-17.78,0)
  round 1.6 hole 1.05: 2(-15.24,0) 3(-12.7,0) 4(-10.16,0) 5(-7.62,0) 6(-5.08,0) 7(-2.54,0) 8(0,0) 9(2.54,0) 10(5.08,0) 11(7.62,0) 12(10.16,0) 13(12.7,0) 14(15.24,0) 15(17.78,0)
LED-TH_BD3.0-P2.54-FD
  round 1.524 hole 0.914: 1(-1.27,0) 2(1.27,0)
RES-TH_BD2.4-L6.3-P10.30-D0.6
  round 1.524 hole 1: 1(-5.15,0) 2(5.15,0)

## Nets
As in the schematic.

Pads without a net: 雨滴传感器1 3
